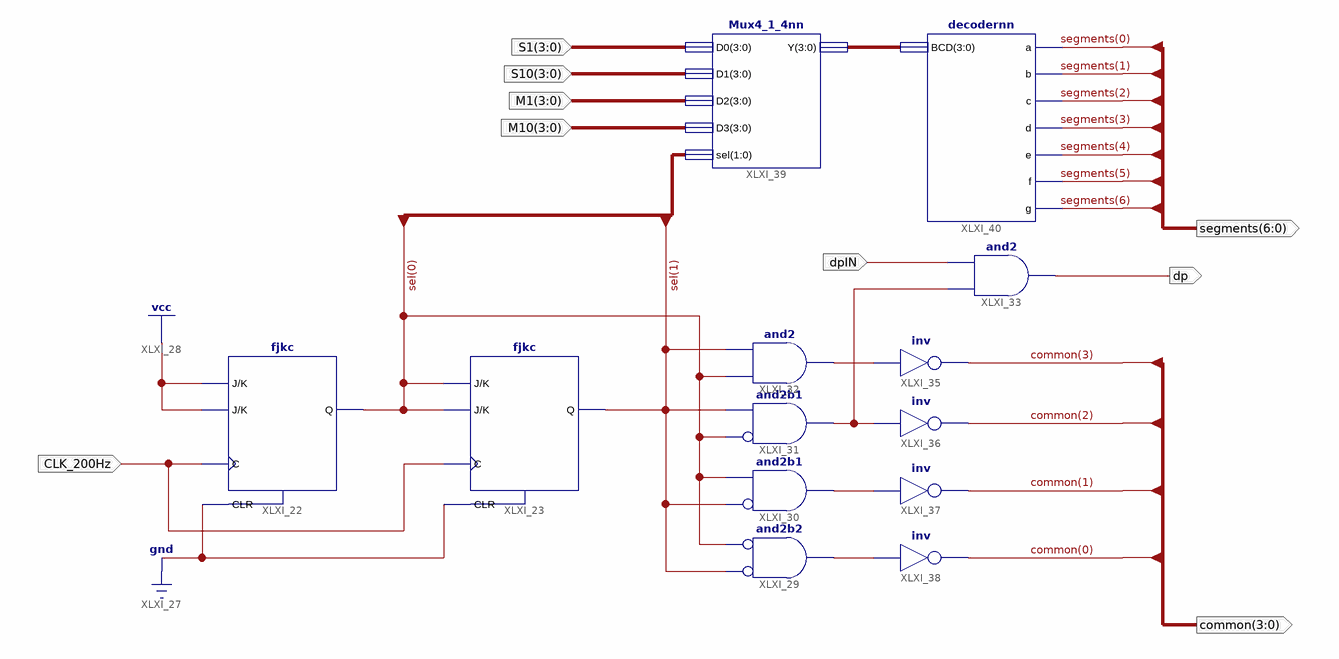
[diagram p0: schematic sheet 1]
// Xilinx ISE schematic Displaynn.sch (spartan6) as structural Verilog: 13 symbols, 9 ports
module Displaynn (
  input  [3:0] S1,
  input  [3:0] S10,
  input  [3:0] M1,
  input  [3:0] M10,
  input  CLK_200Hz,
  input  dpIN,
  output [3:0] common,
  output dp,
  output [6:0] segments
);

  wire XLXN_38, XLXN_40, XLXN_41, XLXN_46;
  wire [1:0] sel;
  wire [3:0] XLXN_28;

  fjkc XLXI_22 (.C(CLK_200Hz), .CLR(1'b0), .J(1'b1), .K(1'b1), .Q(sel[0]));
  fjkc XLXI_23 (.C(CLK_200Hz), .CLR(1'b0), .J(sel[0]), .K(sel[0]), .Q(sel[1]));
  and XLXI_29 (XLXN_41, ~sel[1], ~sel[0]);  // and2b2
  and XLXI_30 (XLXN_40, ~sel[1], sel[0]);  // and2b1
  and XLXI_31 (XLXN_46, ~sel[0], sel[1]);  // and2b1
  and XLXI_32 (XLXN_38, sel[0], sel[1]);
  and XLXI_33 (dp, XLXN_46, dpIN);
  not XLXI_36 (common[2], XLXN_46);
  not XLXI_37 (common[1], XLXN_40);
  not XLXI_38 (common[0], XLXN_41);
  not XLXI_35 (common[3], XLXN_38);
  Mux4_1_4nn XLXI_39 (.D0(S1), .D1(S10), .D2(M1), .D3(M10), .sel(sel), .Y(XLXN_28));
  decodernn XLXI_40 (
    .BCD(XLXN_28), .a(segments[0]), .b(segments[1]), .c(segments[2]), .d(segments[3]), .e(segments[4]),
    .f(segments[5]), .g(segments[6]));
endmodule
